# Altium schematic sheet Top_sheet.SchDoc
size A4; SheetNumber: 1
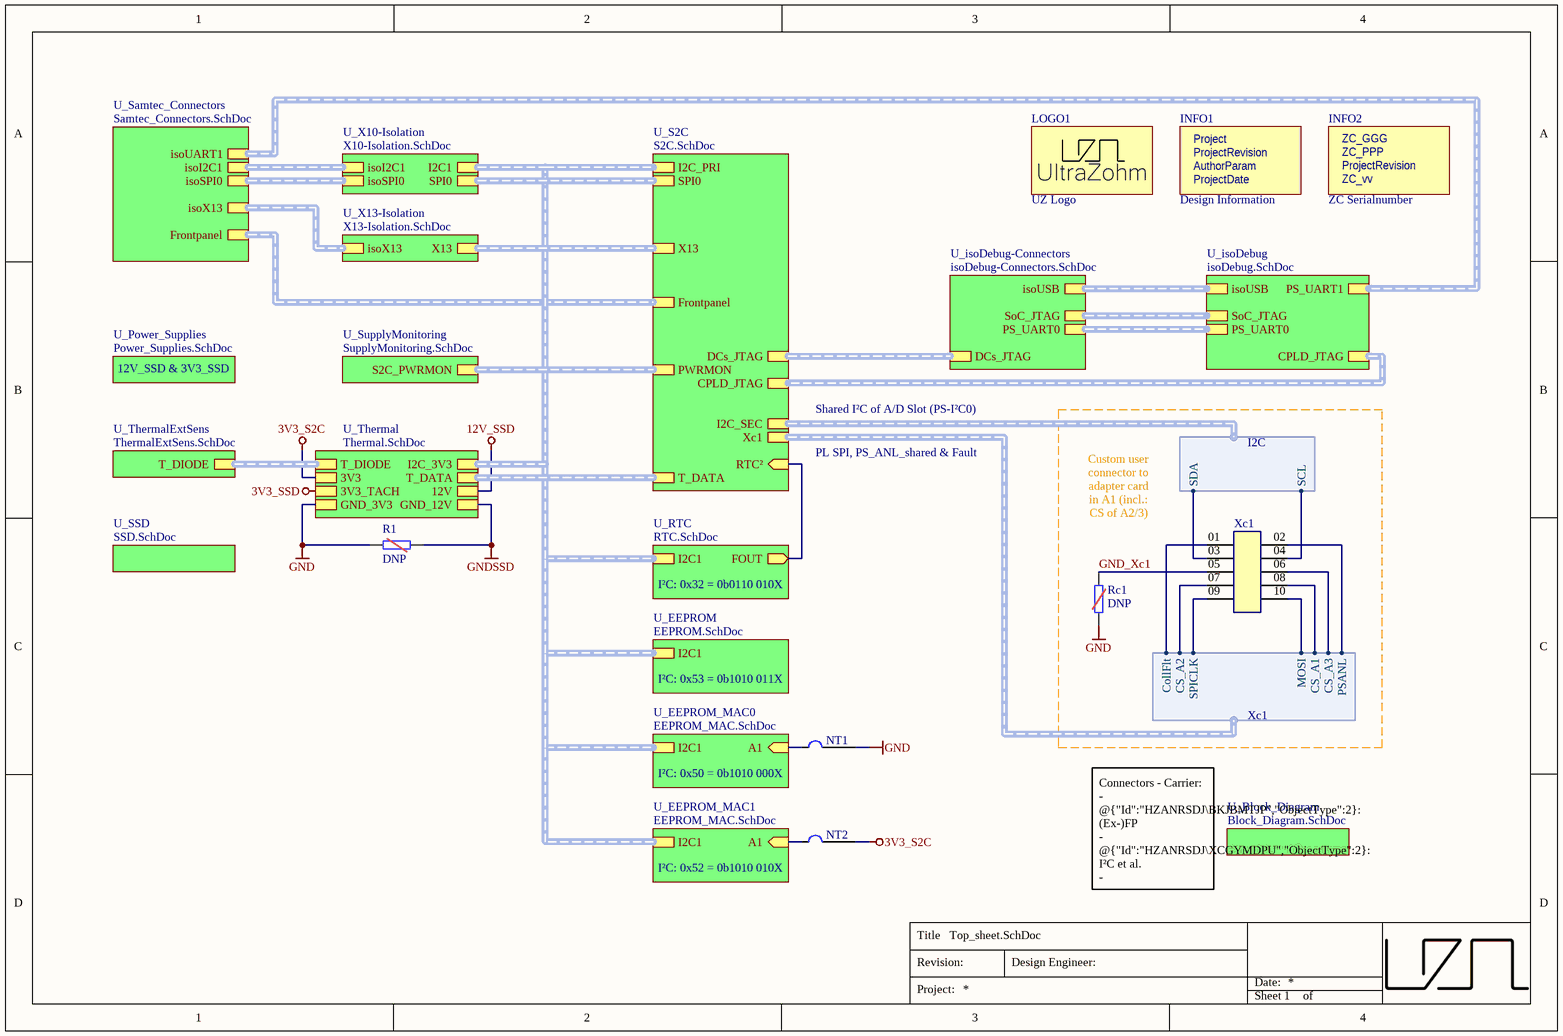
[diagram p0: Top_sheet.SchDoc]

## Parts
INFO1  Design Information  [Design_info2]  (no BOM)
INFO2  ZC Serialnumber  [ZC-Serial]  (no BOM)
LOGO1  UZ Logo  [UZ_Logo_small]  (no BOM)
NT1  Net Tie 1 to 1  [1_to_1_NetTie_0.1mm]  (value not drawn)  (net tie, no BOM)
NT2  Net Tie 1 to 1  [1_to_1_NetTie_0.1mm]  (value not drawn)  (net tie, no BOM)
R1  DNP  [R_1206_TE-DNP]  (no BOM)
Rc1  DNP  [R_1206_TE-DNP]  (no BOM)
Xc1  PH 0.1" SMD 2x05  [TSM-105-01-L-DV]  (value not drawn)

## Sub-sheets
U_Block_Diagram = Block_Diagram.SchDoc: no entries
U_EEPROM = EEPROM.SchDoc: I2C1 (harness I2C)
U_EEPROM_MAC0 = EEPROM_MAC.SchDoc: I2C1 (harness I2C), A1 (in)
U_EEPROM_MAC1 = EEPROM_MAC.SchDoc: I2C1 (harness I2C), A1 (in)
U_isoDebug = isoDebug.SchDoc: SoC_JTAG (harness JTAG), CPLD_JTAG (harness JTAG), PS_UART0 (harness UART), PS_UART1 (harness UART), isoUSB (harness USB)  | SubSheet_SheetNumber: 20
U_isoDebug-Connectors = isoDebug-Connectors.SchDoc: isoUSB (harness USB), SoC_JTAG (harness JTAG), PS_UART0 (harness UART), DCs_JTAG (harness JTAG)
U_Power_Supplies = Power_Supplies.SchDoc: no entries
U_RTC = RTC.SchDoc: I2C1 (harness I2C), FOUT (out)
U_S2C = S2C.SchDoc: T_DATA (harness T_DATA), PWRMON (harness S2C_PWRMON), CPLD_JTAG (harness JTAG), DCs_JTAG (harness JTAG), I2C_PRI (harness I2C), Frontpanel (harness Frontpanel), SPI0 (harness SPI0), X13 (harness X13), I2C_SEC (harness I2C), Xc1 (harness Xc1), RTC² (in)
U_Samtec_Connectors = Samtec_Connectors.SchDoc: Frontpanel (harness Frontpanel), isoUART1 (harness UART), isoI2C1 (harness I2C), isoX13 (harness X13), isoSPI0 (harness SPI0)
U_SSD = SSD.SchDoc: no entries
U_SupplyMonitoring = SupplyMonitoring.SchDoc: S2C_PWRMON (harness S2C_PWRMON)
U_Thermal = Thermal.SchDoc: I2C_3V3 (harness I2C), T_DIODE (harness T_DIODE), T_DATA (harness T_DATA), 12V, 3V3, 3V3_TACH, GND_3V3, GND_12V  | SubSheet_SheetNumber: 25
U_ThermalExtSens = ThermalExtSens.SchDoc: T_DIODE (harness T_DIODE)
U_X10-Isolation = X10-Isolation.SchDoc: isoI2C1 (harness I2C), isoSPI0 (harness SPI0), I2C1 (harness I2C), SPI0 (harness SPI0)
U_X13-Isolation = X13-Isolation.SchDoc: isoX13 (harness X13), X13 (harness X13)

## Harnesses
I2C: SCL, SDA
Xc1: CollFlt, CS_A2, SPICLK, MOSI, CS_A1, CS_A3, PSANL

## Nets
3V3_S2C: NT2.2 ; sheet U_Thermal/3V3
3V3_SSD: sheet U_Thermal/3V3_TACH
12V_SSD: sheet U_Thermal/12V
GND: NT1.2 R1.2 Rc1.2 ; sheet U_Thermal/GND_3V3
GNDSSD: R1.1 ; sheet U_Thermal/GND_12V
GND_Xc1: Rc1.1 Xc1.05
NetNT1_1: NT1.1 ; sheet U_EEPROM_MAC0/A1
NetNT2_1: NT2.1 ; sheet U_EEPROM_MAC1/A1
NetXc1_01: Xc1.01 ; sheet U_S2C/Xc1.CollFlt
NetXc1_02: Xc1.02 ; sheet U_S2C/Xc1.PSANL
NetXc1_03: Xc1.03 ; sheet U_S2C/I2C_SEC.SDA
NetXc1_04: Xc1.04 ; sheet U_S2C/I2C_SEC.SCL
NetXc1_06: Xc1.06 ; sheet U_S2C/Xc1.CS_A3
NetXc1_07: Xc1.07 ; sheet U_S2C/Xc1.CS_A2
NetXc1_08: Xc1.08 ; sheet U_S2C/Xc1.CS_A1
NetXc1_09: Xc1.09 ; sheet U_S2C/Xc1.SPICLK
NetXc1_10: Xc1.10 ; sheet U_S2C/Xc1.MOSI
(unnamed): sheet U_RTC/FOUT, sheet U_S2C/RTC²

## Buses and harness runs
harness sheet U_EEPROM/I2C1 = sheet U_EEPROM_MAC0/I2C1 = sheet U_EEPROM_MAC1/I2C1 = sheet U_RTC/I2C1 = sheet U_S2C/I2C_PRI = sheet U_Thermal/I2C_3V3 = sheet U_X10-Isolation/I2C1
harness sheet U_isoDebug-Connectors/DCs_JTAG = sheet U_S2C/DCs_JTAG
harness sheet U_isoDebug-Connectors/isoUSB = sheet U_isoDebug/isoUSB
harness sheet U_isoDebug-Connectors/PS_UART0 = sheet U_isoDebug/PS_UART0
harness sheet U_isoDebug-Connectors/SoC_JTAG = sheet U_isoDebug/SoC_JTAG
harness sheet U_isoDebug/CPLD_JTAG = sheet U_S2C/CPLD_JTAG
harness sheet U_isoDebug/PS_UART1 = sheet U_Samtec_Connectors/isoUART1
harness sheet U_S2C/Frontpanel = sheet U_Samtec_Connectors/Frontpanel
harness sheet U_S2C/PWRMON = sheet U_SupplyMonitoring/S2C_PWRMON
harness sheet U_S2C/SPI0 = sheet U_X10-Isolation/SPI0
harness sheet U_S2C/T_DATA = sheet U_Thermal/T_DATA
harness sheet U_S2C/X13 = sheet U_X13-Isolation/X13
harness sheet U_Samtec_Connectors/isoI2C1 = sheet U_X10-Isolation/isoI2C1
harness sheet U_Samtec_Connectors/isoSPI0 = sheet U_X10-Isolation/isoSPI0
harness sheet U_Samtec_Connectors/isoX13 = sheet U_X13-Isolation/isoX13
harness sheet U_Thermal/T_DIODE = sheet U_ThermalExtSens/T_DIODE

## Notes on the sheet
- 12V_SSD & 3V3_SSD
- Shared I²C of A/D Slot (PS-I²C0)
- PL SPI, PS_ANL_shared & Fault
- Custom user connector to adapter card in A1 (incl.: CS of A2/3)
- I²C: 0x32 = 0b0110 010X
- I²C: 0x53 = 0b1010 011X
- (near NT1) I²C: 0x50 = 0b1010 000X
- (near NT2) I²C: 0x52 = 0b1010 010X
- Connectors - Carrier:
  - @{"Id":"HZANRSDJ\BKJBMTJP","ObjectType":2}: (Ex-)FP
  - @{"Id":"HZANRSDJ\XCGYMDPU","ObjectType":2}: I²C et al.
  - @{"Id":"NFRUWTDK\GEDVIQXD","ObjectType":2}: D5 signals
  - @{"Id":"HZANRSDJ\LVDAVBXZ","ObjectType":2}: isoGPIO
  - 2x JTAG, 2x SATA
  NB: @{"Id":"NFRUWTDK\GEDVIQXD","ObjectType":2} sources
  the local @{"Id":"LAOQKLBU\YLFQDURX","ObjectType":1}!
- Title
- Revision:
- Design Engineer:
- Date:
- Project:
- Sheet
- of
- (in symbol Design Information) Project; ProjectRevision; AuthorParam; ProjectDate
- (in symbol ZC-Serial) ZC_GGG; ZC_PPP; ProjectRevision; ZC_vv

## Library data of the parts
INFO1 = Design Information: Manufacturer: UltraZohm; Created from: MGremer; Manufacturer Part Number: Design Information; PartID: 12; Created On: 03/11/2021 09:04:23; ComponentLink1Description: https://docs.ultrazohm.com/; ComponentLink1URL: homepage; Component Type: Design Information; Last Updated: 15/04/2025 09:29:36; Supplier 1: -; Supplier Part Number 1: -; Type: Design Information; Value: Design Information; Live Cycle Status: 1
INFO2 = ZC-Serial: Manufacturer: UltraZohm; Value: GGG-PPP-VVvv; Created from: FRosner; Manufacturer Part Number: ZC-Serial; PartID: 58; Created On: 15/04/2025 09:17:14; ComponentLink1Description: https://docs.ultrazohm.com/; ComponentLink1URL: homepage; Component Type: ZC Serialnumber; Last Updated: 15/04/2025 09:17:14; Supplier 1: -; Supplier Part Number 1: -; Type: Serial Number; Live Cycle Status: 1
LOGO1 = Logo small: Manufacturer: UltraZohm; Created from: MGremer; Created: Jan2021_Liegmann; Value: Logo; Manufacturer Part Number: Logo small; PartID: 10; Created On: 03.11.2021 09:04:23; ComponentLink1Description: https://docs.ultrazohm.com/; ComponentLink1URL: homepage; Component Type: Logo; Last Updated: 03.11.2021 09:05:50; Supplier 1: -; Supplier Part Number 1: -; Type: Logo; Live Cycle Status: 1
NT1 NT2 = Net Tie 1 to 1: Net Tie 1 to 1. Joins two nets without producing a DRC error or renaming one of the nets; PartID: 2; Created On: 29/09/2024 15:25:00; Component Type: Net Tie 1 to 1; Last Updated: 29/09/2024 15:25:00; Type: Net Tie (No BOM); Created by: MGeier; Live Cycle Status: 1
R1 Rc1 = UZgen_R_1206_DNP: Generic resistor (DNP); Manufacturer: UZgen; Created from: UZgenTool; Manufacturer Part Number: UZgen_R_1206_DNP; PartID: 595; Created On: 25/03/2025 14:26:15; Value: DNP; Device Package: 1206; Tolerance: -; Mounting Type: SMD; Last Updated: 02/04/2025 19:05:00
Xc1 = UZgen_Conn_PinHead_2x05_SMD_100mil_90deg: 0.1" Double-row Pin Header, 90°-to-PCB SMD, 2x05 Pins, 250V, 3A; Manufacturer: UZgen; Pin Pitch: 0.1" x 0.1"; Pin Orientation: 90° (standing); Created from: UZgenTool; Manufacturer Part Number: UZgen_Conn_PinHead_2x05_SMD_100mil_90deg; PartID: 4; Created On: 18/02/2025 11:27:30; Value: PH 0.1" SMD 2x05; Device Package: SMD 0.1" 2x05; Pin Count: 10; Pin Layout: 2x05; Pin Voltage: 250V; Pin Current: 3A; Mounting Type: SMD; Last Updated: 18/02/2025 11:27:30